# EAGLE schematic ESP_Robo_Board_2 (EAGLE 9.6.2)
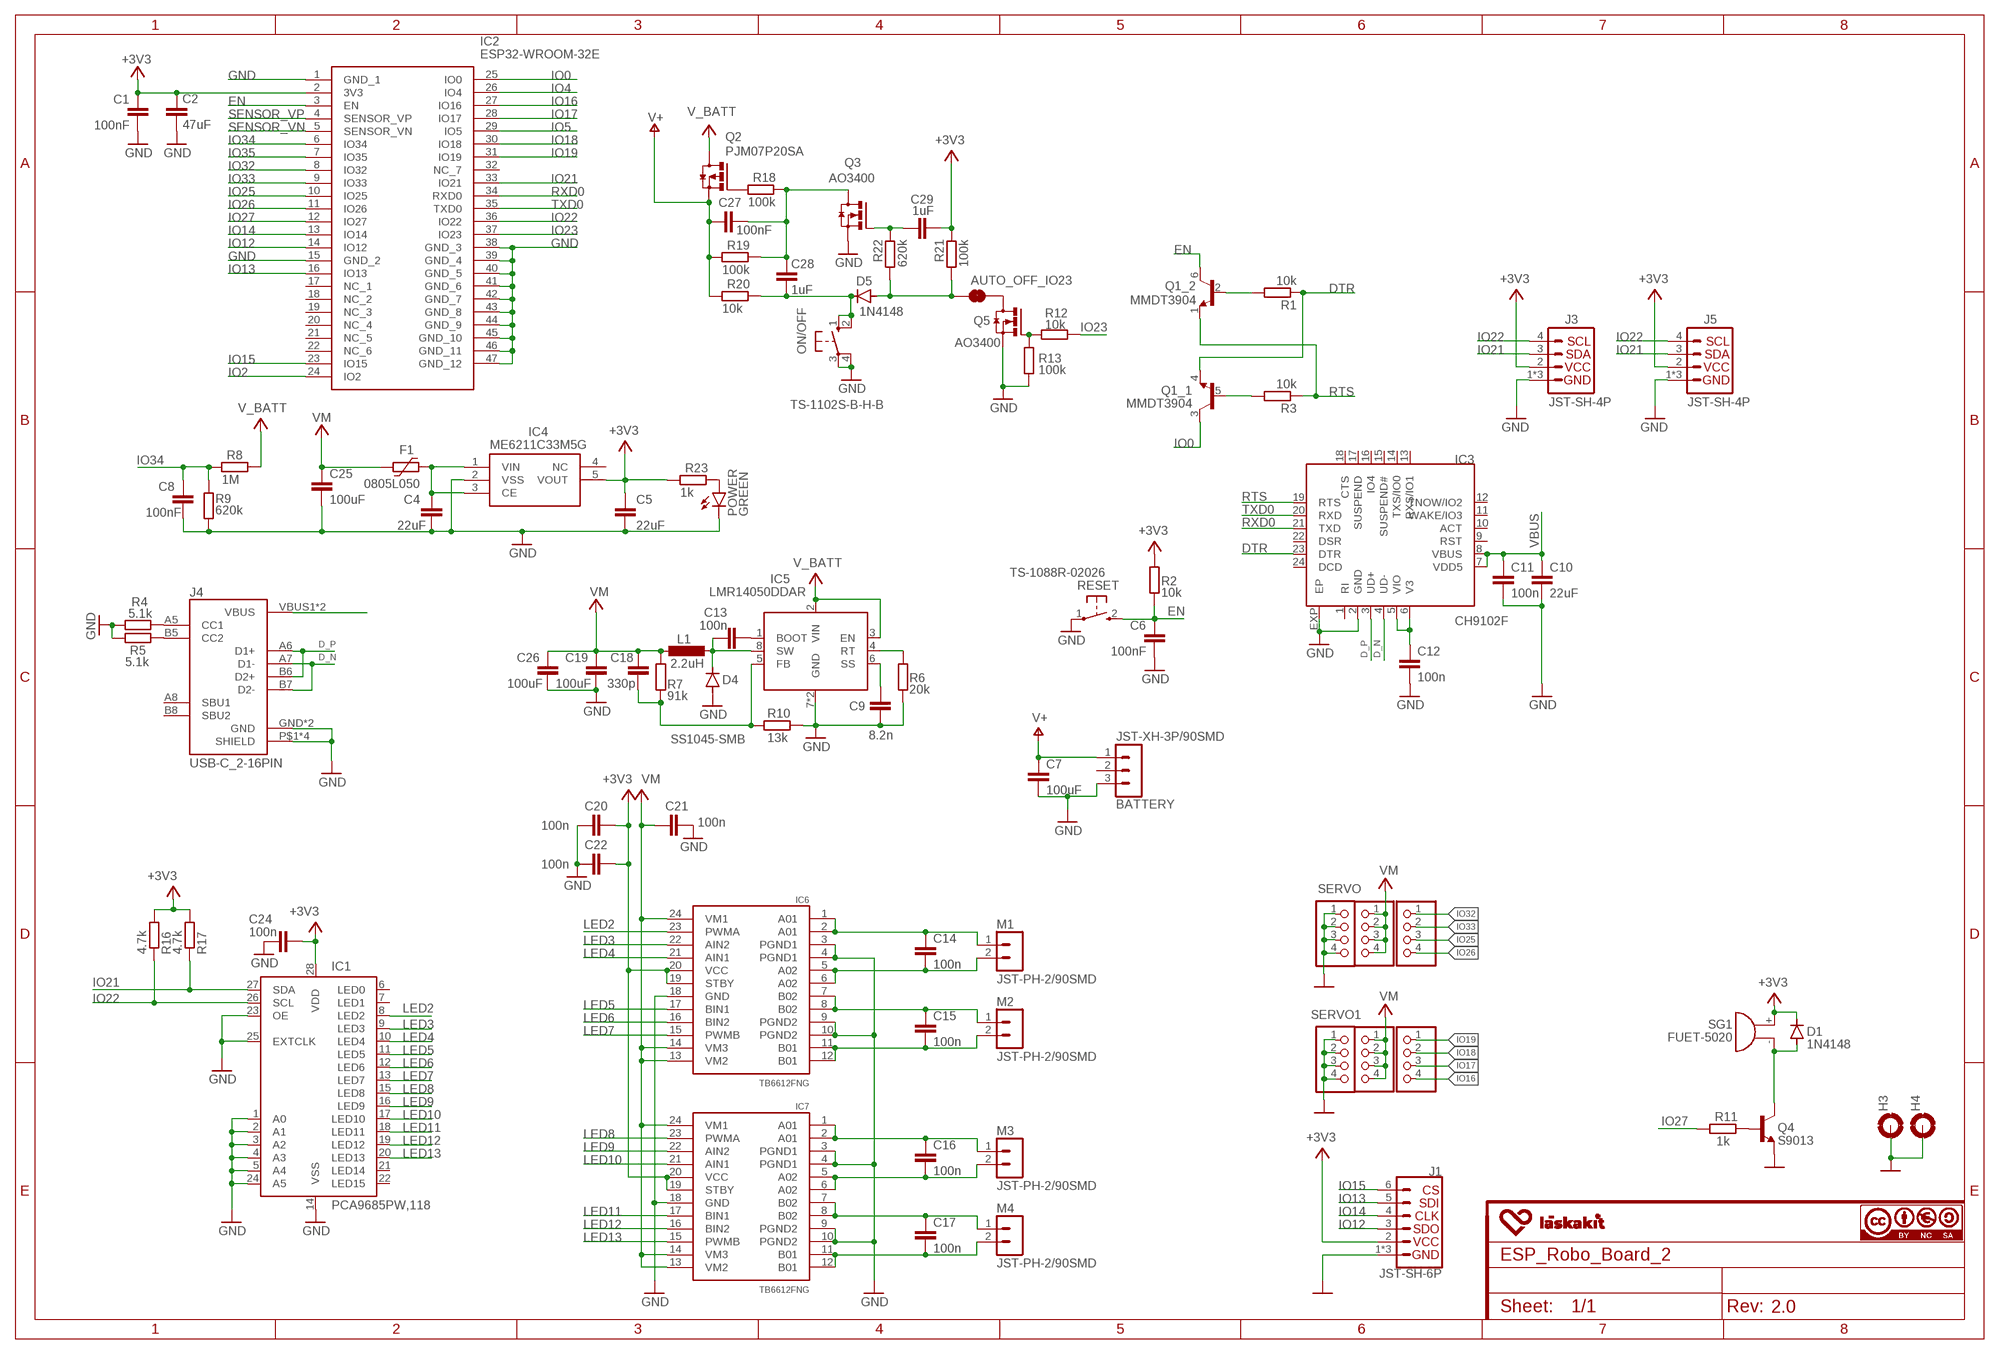
[diagram p0: schematic, sheet 1]
FRAME1 (FRAME-A3L): CREVISION: 2.0

## Parts
1  PINHD_1X4_RED  PINHD-1X4  [1X04]
2  PINHD_1X4_BLACK  PINHD-1X4  [1X04]
5  PINHD_1X4_RED  PINHD-1X4  [1X04]
6  PINHD_1X4_BLACK  PINHD-1X4  [1X04]
AUTO_OFF_IO23  nv  JUMPER-SMT_2_NC_TRACE_SILK  [SMT-JUMPER_2_NC_TRACE_SILK]
BATTERY  JST-XH-3P/90SMD  JST-XH-3/90SMD  [S3B-XH-SM4]
C1  100nF  C-EUC0603  [C0603]
C2  47uF  C-EUC0805  [C0805]
C4  22uF  C-EUC0603  [C0603]
C5  22uF  C-EUC0603  [C0603]
C6  100nF  CAPACITOR_0402  [C0402]
C7  100uF  C-EUC1206  [C1206]
C8  100nF  CAPACITOR_0402  [C0402]
C9  8.2n  C-EUC0603  [C0603]
C10  22uF  C-EUC0603  [C0603]
C11  100n  CAPACITOR_0402  [C0402]
C12  100n  CAPACITOR_0402  [C0402]
C13  100n  C-EUC0603  [C0603]
C14  100n  C-EUC0603  [C0603]
C15  100n  C-EUC0603  [C0603]
C16  100n  C-EUC0603  [C0603]
C17  100n  C-EUC0603  [C0603]
C18  330p  CAPACITOR_0402  [C0402]
C19  100uF  C-EUC1206  [C1206]
C20  100n  C-EUC0603  [C0603]
C21  100n  C-EUC0603  [C0603]
C22  100n  C-EUC0603  [C0603]
C24  100n  C-EUC0603  [C0603]
C25  100uF  C-EUC1206  [C1206]
C26  100uF  C-EUC1206  [C1206]
C27  100nF  CAPACITOR_0402  [C0402]
C28  1uF  C-EUC0603  [C0603]
C29  1uF  C-EUC0603  [C0603]
D1  1N4148  DIODE-SOD323-R  [SOD323-R]
D4  SS1045-SMB  DIODE-SMB  [SMB]
D5  1N4148  DIODE-SOD323-R  [SOD323-R]
F1  0805L050  [0805L]
H3  MOUNT-PAD-ROUND2.5  [2,5-PAD]
H4  MOUNT-PAD-ROUND2.5  [2,5-PAD]
IC1  PCA9685PW,118  [TSSOP28]
IC2  ESP32-WROOM-32E  [ESP32WROOM32E]
IC3  CH9102F  USB_UART_CONVERTOR_CH9102  [QFN24-4X4]
IC4  ME6211C33M5G  LDO_ME6211C33M5G  [SOT23-5]
IC5  LMR14050DDAR  [SO08-EPAD]
IC6  TB6612FNG  MOTOR_DRIVER_TB6612FNG  [SSOP24]
IC7  TB6612FNG  MOTOR_DRIVER_TB6612FNG  [SSOP24]
J1  JST-SH-6P  USUP_SPI_CONNECTOR_VERT  [1X06_1MM_RA_VERT]
J3  JST-SH-4P  USUP_I2C_CONNECTOR_VERT  [1X04_1MM_RA_VERT]
J4  USB-C_2-16PIN  [USBC_USB-C-16P-5]
J5  JST-SH-4P  USUP_I2C_CONNECTOR_VERT  [1X04_1MM_RA_VERT]
L1  2.2uH  INDUCTOR_5.4X5.2  [L5.4X5.2]
M1  JST-PH-2/90SMD  [S2B-PH-SM4]
M2  JST-PH-2/90SMD  [S2B-PH-SM4]
M3  JST-PH-2/90SMD  [S2B-PH-SM4]
M4  JST-PH-2/90SMD  [S2B-PH-SM4]
ON/OFF  TS-1102S-B-H-B  10-XX-SMD  [B3F-SMD]
POWER  GREEN  LEDCHIPLED_0402  [CHIPLED_0402]
Q1  MMDT3904  TRANS_NPN_DUAL-MBT3904DW1T1  [SC70-6]
Q2  PJM07P20SA  MOSFET_P-SOT-23  [SOT23]
Q3  AO3400  MOSFET_N-SOT-23  [SOT23]
Q4  S9013  BC817-16-NPN-SOT23-BEC  [SOT23-BEC]
Q5  AO3400  MOSFET_N-SOT-23  [SOT23]
R1  10k  R-EU_R0402  [R0402]
R2  10k  R-EU_R0402  [R0402]
R3  10k  R-EU_R0402  [R0402]
R4  5.1k  R-EU_R0402  [R0402]
R5  5.1k  R-EU_R0402  [R0402]
R6  20k  R-EU_R0402  [R0402]
R7  91k  R-EU_R0402  [R0402]
R8  1M  R-EU_R0402  [R0402]
R9  620k  R-EU_R0402  [R0402]
R10  13k  R-EU_R0402  [R0402]
R11  1k  R-EU_R0402  [R0402]
R12  10k  R-EU_R0402  [R0402]
R13  100k  R-EU_R0402  [R0402]
R16  4.7k  R-EU_R0402  [R0402]
R17  4.7k  R-EU_R0402  [R0402]
R18  100k  R-EU_R0402  [R0402]
R19  100k  R-EU_R0402  [R0402]
R20  10k  R-EU_R0402  [R0402]
R21  100k  R-EU_R0402  [R0402]
R22  620k  R-EU_R0402  [R0402]
R23  1k  R-EU_R0402  [R0402]
RESET  TS-1088R-02026  MOMENTARY_SWITCH_TS-1088R-02026  [TS1088R02026]
SERVO  PINHD_1X4_YELLOW  PINHD-1X4  [1X04]
SERVO1  PINHD_1X4_YELLOW  PINHD-1X4  [1X04]
SG1  FUET-5020  PASSIVE_BUZZER_3V_FUET-5020  [FUET-5020]

## Nets
+3V3: C1.1 C2.1 C5.1 C20.2 C22.2 C24.2 C29.1 D1.C IC1.28(VDD) IC2.2(3V3) IC4.5(VOUT) IC6.19(STBY) IC6.20(VCC) IC7.19(STBY) IC7.20(VCC) J1.2(VCC) J3.2(VCC) J5.2(VCC) R2.1 R16.2 R17.2 R21.2 R23.1 SG1.+
+6V: 1.1 1.2 1.3 1.4 5.1 5.2 5.3 5.4 C18.1 C19.1 C21.1 C25.1 C26.1 F1.2 IC6.13(VM2) IC6.14(VM3) IC6.24(VM1) IC7.13(VM2) IC7.14(VM3) IC7.24(VM1) L1.2 R7.1 ; supply symbol labelled VM
D_N: IC3.4(UD-) J4.A7(D1-) J4.B7(D2-)
D_P: IC3.3(UD+) J4.A6(D1+) J4.B6(D2+)
DTR: IC3.23(DTR) Q1.4(_1:E) R1.1
EN: C6.1 IC2.3(EN) Q1.6(_2:C) R2.2 RESET.2
GND: 2.1 2.2 2.3 2.4 6.1 6.2 6.3 6.4 BATTERY.3 C1.2 C2.2 C4.2 C5.2 C6.2 C7.2 C8.2 C9.2 C10.2 C11.2 C12.2 C19.2 C20.1 C21.2 C22.1 C24.1 C25.2 C26.2 D4.A H3.1(MOUNT) H4.1(MOUNT) IC1.1(A0) IC1.2(A1) IC1.3(A2) IC1.4(A3) IC1.5(A4) IC1.14(VSS) IC1.23(OE) IC1.24(A5) IC1.25(EXTCLK) IC2.1(GND_1) IC2.15(GND_2) IC2.38(GND_3) IC2.39(GND_4) IC2.40(GND_5) IC2.41(GND_6) IC2.42(GND_7) IC2.43(GND_8) IC2.44(GND_9) IC2.45(GND_10) IC2.46(GND_11) IC2.47(GND_12) IC3.2(GND) IC3.EXP(EP) IC4.2(VSS) IC5.7(GND) IC5.EPAD(GND) IC6.3(PGND1) IC6.4(PGND1) IC6.9(PGND2) IC6.10(PGND2) IC6.18(GND) IC7.3(PGND1) IC7.4(PGND1) IC7.9(PGND2) IC7.10(PGND2) IC7.18(GND) J1.1(GND) J1.NC1(GND) J1.NC2(GND) J3.1(GND) J3.NC1(GND) J3.NC2(GND) J4.GND J4.GND2(GND) J4.P$1(SHIELD) J4.P$2(SHIELD) J4.P$3(SHIELD) J4.P$4(SHIELD) J5.1(GND) J5.NC1(GND) J5.NC2(GND) ON/OFF.3(P) ON/OFF.4(P1) POWER.C Q3.2(S) Q4.E Q5.2(S) R4.1 R5.1 R6.2 R9.1 R10.2 R13.1 RESET.1
IO0: IC2.25(IO0) Q1.3(_1:C)
IO2: IC2.24(IO2)
IO4: IC2.26(IO4)
IO5: IC2.29(IO5)
IO12: IC2.14(IO12) J1.3(SDO)
IO13: IC2.16(IO13) J1.5(SDI)
IO14: IC2.13(IO14) J1.4(CLK)
IO15: IC2.23(IO15) J1.6(CS)
IO16: IC2.27(IO16) SERVO1.4
IO17: IC2.28(IO17) SERVO1.3
IO18: IC2.30(IO18) SERVO1.2
IO19: IC2.31(IO19) SERVO1.1
IO21: IC1.27(SDA) IC2.33(IO21) J3.3(SDA) J5.3(SDA) R17.1
IO22: IC1.26(SCL) IC2.36(IO22) J3.4(SCL) J5.4(SCL) R16.1
IO23: IC2.37(IO23) R12.2
IO25: IC2.10(IO25) SERVO.3
IO26: IC2.11(IO26) SERVO.4
IO27: IC2.12(IO27) R11.1
IO32: IC2.8(IO32) SERVO.1
IO33: IC2.9(IO33) SERVO.2
IO34: C8.1 IC2.6(IO34) R8.1 R9.2
IO35: IC2.7(IO35)
LED2: IC1.8(LED2) IC6.23(PWMA)
LED3: IC1.9(LED3) IC6.22(AIN2)
LED4: IC1.10(LED4) IC6.21(AIN1)
LED5: IC1.11(LED5) IC6.17(BIN1)
LED6: IC1.12(LED6) IC6.16(BIN2)
LED7: IC1.13(LED7) IC6.15(PWMB)
LED8: IC1.15(LED8) IC7.23(PWMA)
LED9: IC1.16(LED9) IC7.22(AIN2)
LED10: IC1.17(LED10) IC7.21(AIN1)
LED11: IC1.18(LED11) IC7.17(BIN1)
LED12: IC1.19(LED12) IC7.16(BIN2)
LED13: IC1.20(LED13) IC7.15(PWMB)
N$1: C4.1 F1.1 IC4.1(VIN) IC4.3(CE)
N$2: J4.A5(CC1) R4.2
N$3: C13.1 D4.C IC5.8(SW) L1.1
N$4: Q1.5(_1:B) R3.2
N$5: C9.1 IC5.6(SS)
N$6: IC5.4(RT) R6.1
N$7: J4.B5(CC2) R5.2
N$8: Q4.B R11.2
N$9: POWER.A R23.2
N$10: C13.2 IC5.1(BOOT)
N$12: Q1.2(_2:B) R1.2
N$13: Q5.1(G) R12.1 R13.2
N$14: D1.A Q4.C SG1.-
N$15: C12.1 IC3.5(VIO) IC3.6(V3)
N$16: AUTO_OFF_IO23.2 Q5.3(D)
N$17: C18.2 IC5.5(FB) R7.2 R10.1
N$18: C14.1 IC6.1(A01) IC6.2(A01) M1.1
N$19: C14.2 IC6.5(A02) IC6.6(A02) M1.2
N$20: C15.1 IC6.7(B02) IC6.8(B02) M2.1
N$22: Q2.1(G) R18.1
N$23: C15.2 IC6.11(B01) IC6.12(B01) M2.2
N$24: C16.1 IC7.1(A01) IC7.2(A01) M3.1
N$25: C28.2 D5.C ON/OFF.1(S) ON/OFF.2(S1) R20.2
N$26: C16.2 IC7.5(A02) IC7.6(A02) M3.2
N$27: C17.1 IC7.7(B02) IC7.8(B02) M4.1
N$28: C27.2 C28.1 Q3.3(D) R18.2 R19.2
N$29: C17.2 IC7.11(B01) IC7.12(B01) M4.2
N$30: C29.2 Q3.1(G) R22.2
N$31: AUTO_OFF_IO23.1 D5.A R21.1 R22.1
RTS: IC3.19(RTS) Q1.1(_2:E) R3.1
RXD0: IC2.34(RXD0) IC3.21(TXD)
SENSOR_VN: IC2.5(SENSOR_VN)
SENSOR_VP: IC2.4(SENSOR_VP)
TXD0: IC2.35(TXD0) IC3.20(RXD)
V+: BATTERY.1 C7.1 C27.1 Q2.2(S) R19.1 R20.1
V_BATT: IC5.2(VIN) IC5.3(EN) Q2.3(D) R8.2
VBUS: C10.1 C11.1 IC3.7(VDD5) IC3.8(VBUS) J4.VBUS1(VBUS) J4.VBUS2(VBUS)
Unconnected: BATTERY.2 IC1.6(LED0) IC1.7(LED1) IC1.21(LED14) IC1.22(LED15) IC2.17(NC_1) IC2.18(NC_2) IC2.19(NC_3) IC2.20(NC_4) IC2.21(NC_5) IC2.22(NC_6) IC2.32(NC_7) IC3.1(RI) IC3.9(RST) IC3.10(ACT) IC3.11(WAKE/IO3) IC3.12(TNOW/IO2) IC3.13(RXS/IO1) IC3.14(TXS/IO0) IC3.15(SUSPEND#) IC3.16(IO4) IC3.17(SUSPEND) IC3.18(CTS) IC3.22(DSR) IC3.24(DCD) IC4.4(NC) J4.A8(SBU1) J4.B8(SBU2)

## Library data of the parts
1 2 5 6 SERVO SERVO1 = LasKKit-Connectors:PINHD-1X4: PIN HEADER
AUTO_OFF_IO23 = LaskaKit-Jumpers:JUMPER-SMT_2_NC_TRACE: Normally closed trace jumper This jumper has a trace between two pads so it's normally closed (NC). Use a razor knife to open the connection. For best results follow the IPC guidelines for cutting traces: Cutout at least 0.063 mm (0.005 in). Remove all loose material to clean up the cut area. Seal the cut with an approved epoxy. Reapply solder to reclose the connection.
BATTERY = LasKKit-Connectors:JST-XH-3
C1 C2 C4 C7 C9 C10 C13-C17 C19-C22 C24-C26 C28 C29 = rcl:C-EU: CAPACITOR, European symbol; SPICEPREFIX: C
C5 = rcl:C-EU: CAPACITOR, European symbol; LCSC_PART: C19666; SPICEPREFIX: C
C6 C8 C11 C12 C18 C27 = LasKKIT-Passive:CAPACITOR
D1 = LasKKit-Discrete:DIODE-: DIODE; LCSC_PART: C94001
D4 = diode:DIODE-: DIODE; LCSC_PART: C2903947
D5 = LasKKit-Discrete:DIODE-: DIODE
F1 = polyfuse-smd_10:?: Polyfuse Resettable PTC Source: http://www.littelfuse.com/products/resettable-ptcs.aspx; LCSC_PART: C66452; MF: Littelfuse; MPN: 0805L050; OC_FARNELL: 1832103; OC_NEWARK: 18M4776
H3 H4 = LasKKit-Holes:MOUNT-PAD-ROUND: MOUNTING PAD, round
IC1 = LasKKit-IC:PCA9685: 16-channel, 12-bit PWM Fm+ I2C-bus LED controller; LCSC_PART: C2678753
IC2 = LasKKit-Modules:ESP32-WROOM-32E: ESP32-D0WD-V3 embedded, Xtensa dual-core 32-bit LX6 microprocessor, up to 240 MHz Source: Datasheet <https://www.espressif.com/sites/default/files/documentation/esp32-wroom-32e_esp32-wroom-32ue_datasheet_en.pdf>; DESCRIPTION: ESP32-D0WD-V3 embedded, Xtensa dual-core 32-bit LX6 microprocessor, up to 240 MHz; HEIGHT: 3.25mm; MANUFACTURER_NAME: Espressif Systems; MANUFACTURER_PART_NUMBER: ESP32-WROOM-32E
IC3 = LasKKit-IC:USB_UART_CONVERTOR_CH9102: Single-Chip USB to UART Bridge
IC4 = LasKKit-Power:LDO_ME6211C33M5G: High Speed LDO Regulators, High PSRR, Low noise, ME6211 Series Source: Datasheet <http://xinhuidianzi.com.cn/UploadSysFiles/files/LDO-series/ME6211-Series_E15.0.pdf>; DESCRIPTION: High Speed LDO Regulators, High PSRR, Low noise, ME6211 Series; HEIGHT: 1.45mm; MANUFACTURER_NAME: Microne; MANUFACTURER_PART_NUMBER: ME6211C33M5G
IC5 = LasKKit-Power:LMR14050; LCSC_PART: C155484
IC6 IC7 = LasKKit-IC:MOTOR_DRIVER_TB6612FNG: Toshiba 1A dual motor driver IC-09363; PROD_ID: IC-09363
J1 = LasKKit-Connectors:USUP_SPI_CONNECTOR: LaskaKit SPI Standard μŠup Connector An SMD 1mm pitch JST connector makes it easy and quick (Šup) to connect SPI devices to each other. The μŠup system enables fast and solderless connection between popular platforms and various sensors and actuators.; LCSC_PART: C145963
J3 J5 = LasKKit-Connectors:USUP_I2C_CONNECTOR: LaskaKit I2C Standard μŠup Connector An SMD 1mm pitch JST connector makes it easy and quick (Šup) to connect I2C devices to each other. The μŠup system enables fast and solderless connection between popular platforms and various sensors and actuators.; LCSC_PART: C371588
J4 = LasKKit-Connectors:USB-C_2: https://lcsc.com/product-detail/USB-Connectors_G-Switch-GT-USB-7010B_C2837092.html; LCSC_PART: C2837092
L1 = LasKKIT-Passive:INDUCTOR; LCSC_PART: C351096
M1-M4 = LasKKit-Connectors:JST-PH-2: HEADER; LCSC_PART: C47647
ON/OFF = LasKKit-Switch:10-XX: OMRON SWITCH
POWER = LasKKit-Discrete:LED: LED OSRAM: - CHIPLED LG R971, LG N971, LY N971, LG Q971, LY Q971, LO R971, LY R971 LH N974, LH R974 LS Q976, LO Q976, LY Q976 LO Q996 - Hyper CHIPLED LW Q18S LB Q993, LB Q99A, LB R99A - SideLED LS A670, LO A670, LY A670, LG A670, LP A670 LB A673, LV A673, LT A673, LW A673 LH A674 LY A675 LS A676, LA A676, LO A676, LY A676, LW A676 LS A679, LY A679, LG A679 - Hyper Micro SIDELED® LS Y876, LA Y876, LO Y876, LY Y876 LT Y87S - SmartLED LW L88C, LW L88S LB L89C, LB L89S, LG L890 LS L89K, LO L89K, LY L89K LS L896, LA L896, LO L896, LY L896 - TOPLED LS T670, LO T670, LY T670, LG T670, LP T670 LSG T670, LSP T670, LSY T670, LOP T670, LYG T670 LG T671, LOG T671, LSG T671 LB T673, LV T673, LT T673, LW T673 LH T674 LS T676, LA T676, LO T676, LY T676, LB T676, LH T676, LSB T676, LW T676 LB T67C, LV T67C, LT T67C, LS T67K, LO T67K, LY T67K, LW E67C LS E67B, LA E67B, LO E67B, LY E67B, LB E67C, LV E67C, LT E67C LW T67C LS T679, LY T679, LG T679 LS T770, LO T770, LY T770, LG T770, LP T770 LB T773, LV T773, LT T773, LW T773 LH T774 LS E675, LA E675, LY E675, LS T675 LS T776, LA T776, LO T776, LY T776, LB T776 LHGB T686 LT T68C, LB T68C - Hyper Mini TOPLED® LB M676 - Mini TOPLED Santana® LG M470 LS M47K, LO M47K, LY M47K Source: http://www.osram.convergy.de LUXEON: - LUMILED® LXK2-PW12-R00, LXK2-PW12-S00, LXK2-PW14-U00, LXK2-PW14-V00 LXK2-PM12-R00, LXK2-PM12-S00, LXK2-PM14-U00 LXK2-PE12-Q00, LXK2-PE12-R00, LXK2-PE12-S00, LXK2-PE14-T00, LXK2-PE14-U00 LXK2-PB12-K00, LXK2-PB12-L00, LXK2-PB12-M00, LXK2-PB14-N00, LXK2-PB14-P00, LXK2-PB14-Q00 LXK2-PR12-L00, LXK2-PR12-M00, LXK2-PR14-Q00, LXK2-PR14-R00 LXK2-PD12-Q00, LXK2-PD12-R00, LXK2-PD12-S00 LXK2-PH12-R00, LXK2-PH12-S00 LXK2-PL12-P00, LXK2-PL12-Q00, LXK2-PL12-R00 Source: www.luxeon.com KINGBRIGHT: KA-3528ASYC Source: www.kingbright.com
Q1 = LasKKit-Discrete:TRANS_NPN_DUAL: Dual NPN Transistors in Single Package The MBT3904W1 puts two general purpose 3904 NPN transistors in a single package. Datasheet <http://www.onsemi.com/pub_link/Collateral/MBT3904DW1T1-D.PDF> SparkFun Products: SparkFun ESP32 Thing <https://www.sparkfun.com/products/13907>; LCSC_PART: C268586; PROD_ID: TRANS-13337
Q2 = LasKKit-Discrete:MOSFET_P; LCSC_PART: C2856842
Q3 Q5 = LasKKit-Discrete:MOSFET_N; LCSC_PART: C693097
Q4 = transistor:*-NPN-: NPN Transistror BF959 corrected 2008.03.06; LCSC_PART: C52801
R1-R10 R12 R13 R16-R23 = rcl:R-EU_: RESISTOR, European symbol; SPICEPREFIX: R
R11 = rcl:R-EU_: RESISTOR, European symbol; LCSC_PART: C22548; SPICEPREFIX: R
RESET = LasKKit-Switch:MOMENTARY_SWITCH_TS-1088R-02026: SMD,3x4x2.0mm Tactile Switches Source: Datasheet <https://datasheet.lcsc.com/szlcsc/1912111437_XUNPU-TS-1088R-02026_C455280.pdf>; DESCRIPTION: SMD,3x4x2.0mm Tactile Switches; HEIGHT: 2.2mm; LCSC_PART: C455280; MANUFACTURER_NAME: XUNPU; MANUFACTURER_PART_NUMBER: TS-1088R-02026
SG1 = LasKKit-Electromechanical:PASSIVE_BUZZER_3V; LCSC_PART: C391029

## Net classes
1 power: width 0.152 mm, drill 0.33 mm, clearance 0.152 mm